# EAGLE design pwmTransmitter (EAGLE 9.6.2)
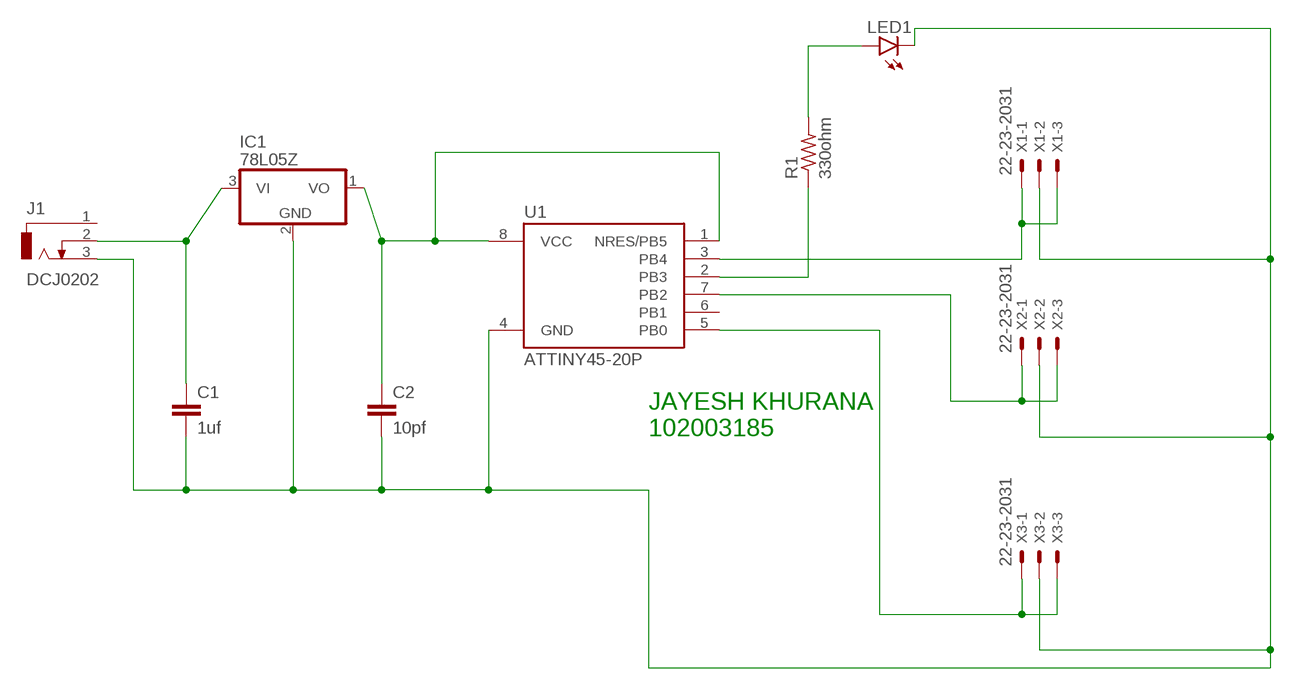
[diagram p0: schematic, sheet 1]

## Parts
C1  1uf  C2.5/2  [C2.5-2]
C2  10pf  C2.5/2  [C2.5-2]
IC1  78L05Z  [TO92]
J1  DCJ0202  [DCJ0202]
LED1  LED3MM  [LED3MM]
R1  330ohm  R-US_0207/10  [0207/10]
U1  ATTINY45-20P  [PDIP08_300MIL]
X1  22-23-2031  [22-23-2031]
X2  22-23-2031  [22-23-2031]
X3  22-23-2031  [22-23-2031]

## Nets
N$1: C1.1 IC1.3(VI) J1.2
N$2: C1.2 C2.2 IC1.2(GND) J1.3 LED1.K(C) U1.4(GND) X1.2 X2.2 X3.2
N$3: C2.1 IC1.1(VO) U1.1(NRES/PB5) U1.8(VCC)
N$4: R1.1 U1.2(PB3)
N$5: U1.3(PB4) X1.1 X1.3
N$6: U1.7(PB2) X2.1 X2.3
N$7: U1.5(PB0) X3.1 X3.3
N$8: LED1.A R1.2
Unconnected: J1.1 U1.6(PB1)

## Notes on the sheet
- JAYESH KHURANA
  102003185

## Library data of the parts
C1 C2 = capacitor-wima:C: CAPACITOR naming: grid - package width
IC1 = linear:78*: Positive VOLTAGE REGULATOR Source: http://cache.national.com/ds/LM/LM78L05.pdf http://www.fairchildsemi.com/ds/LM/LM7805.pdf
J1 = con-jack:DCJ0202: DC POWER JACK Source: DCJ0202.pdf; OC_FARNELL: unknown; OC_NEWARK: unknown
LED1 = led:LED: LED OSRAM: - CHIPLED LG R971, LG N971, LY N971, LG Q971, LY Q971, LO R971, LY R971 LH N974, LH R974 LS Q976, LO Q976, LY Q976 LO Q996 - Hyper CHIPLED LW Q18S LB Q993, LB Q99A, LB R99A - SideLED LS A670, LO A670, LY A670, LG A670, LP A670 LB A673, LV A673, LT A673, LW A673 LH A674 LY A675 LS A676, LA A676, LO A676, LY A676, LW A676 LS A679, LY A679, LG A679 - Hyper Micro SIDELED® LS Y876, LA Y876, LO Y876, LY Y876 LT Y87S - SmartLED LW L88C, LW L88S LB L89C, LB L89S, LG L890 LS L89K, LO L89K, LY L89K LS L896, LA L896, LO L896, LY L896 - TOPLED LS T670, LO T670, LY T670, LG T670, LP T670 LSG T670, LSP T670, LSY T670, LOP T670, LYG T670 LG T671, LOG T671, LSG T671 LB T673, LV T673, LT T673, LW T673 LH T674 LS T676, LA T676, LO T676, LY T676, LB T676, LH T676, LSB T676, LW T676 LB T67C, LV T67C, LT T67C, LS T67K, LO T67K, LY T67K, LW E67C LS E67B, LA E67B, LO E67B, LY E67B, LB E67C, LV E67C, LT E67C LW T67C LS T679, LY T679, LG T679 LS T770, LO T770, LY T770, LG T770, LP T770 LB T773, LV T773, LT T773, LW T773 LH T774 LS E675, LA E675, LY E675, LS T675 LS T776, LA T776, LO T776, LY T776, LB T776 LHGB T686 LT T68C, LB T68C - Hyper Mini TOPLED® LB M676 - Mini TOPLED Santana® LG M470 LS M47K, LO M47K, LY M47K Source: http://www.osram.convergy.de LUXEON: - LUMILED® LXK2-PW12-R00, LXK2-PW12-S00, LXK2-PW14-U00, LXK2-PW14-V00 LXK2-PM12-R00, LXK2-PM12-S00, LXK2-PM14-U00 LXK2-PE12-Q00, LXK2-PE12-R00, LXK2-PE12-S00, LXK2-PE14-T00, LXK2-PE14-U00 LXK2-PB12-K00, LXK2-PB12-L00, LXK2-PB12-M00, LXK2-PB14-N00, LXK2-PB14-P00, LXK2-PB14-Q00 LXK2-PR12-L00, LXK2-PR12-M00, LXK2-PR14-Q00, LXK2-PR14-R00 LXK2-PD12-Q00, LXK2-PD12-R00, LXK2-PD12-S00 LXK2-PH12-R00, LXK2-PH12-S00 LXK2-PL12-P00, LXK2-PL12-Q00, LXK2-PL12-R00 Source: www.luxeon.com KINGBRIGHT: KA-3528ASYC Source: www.kingbright.com
R1 = rcl:R-US_: RESISTOR, American symbol; SPICEPREFIX: R
U1 = _hhn_attiny25_45_85:ATTINY45*: ATMEL ATtiny 45 Packages: P = PDIP 08 30mil S = SOIC 08 EIAJ 208mil X = TSSOP 08 4.4mm Technologies Note: for complete ordering code (temp. range, finish, tape&reel etc.) see www.atmel.com • Supply Voltage: V = (1.8…5.5)V | [blank] = (2.7…5.5)V • Speed: 10 = 10 MHz | 20 = 20 MHz Author: Dipl.-Ing. FH Rainer Bayer HHN Hochschule Heilbronn (Heilbronn University), rainer.bayer@hs-heilbronn.de Ingenieurbüro ing-rb, mail@ing-rb.de
X1-X3 = con-molex:22-23-2031: .100" (2.54mm) Center Header - 3 Pin; MF: MOLEX; MPN: 22-23-2031; OC_FARNELL: 1462950; OC_NEWARK: 30C0862

## Board
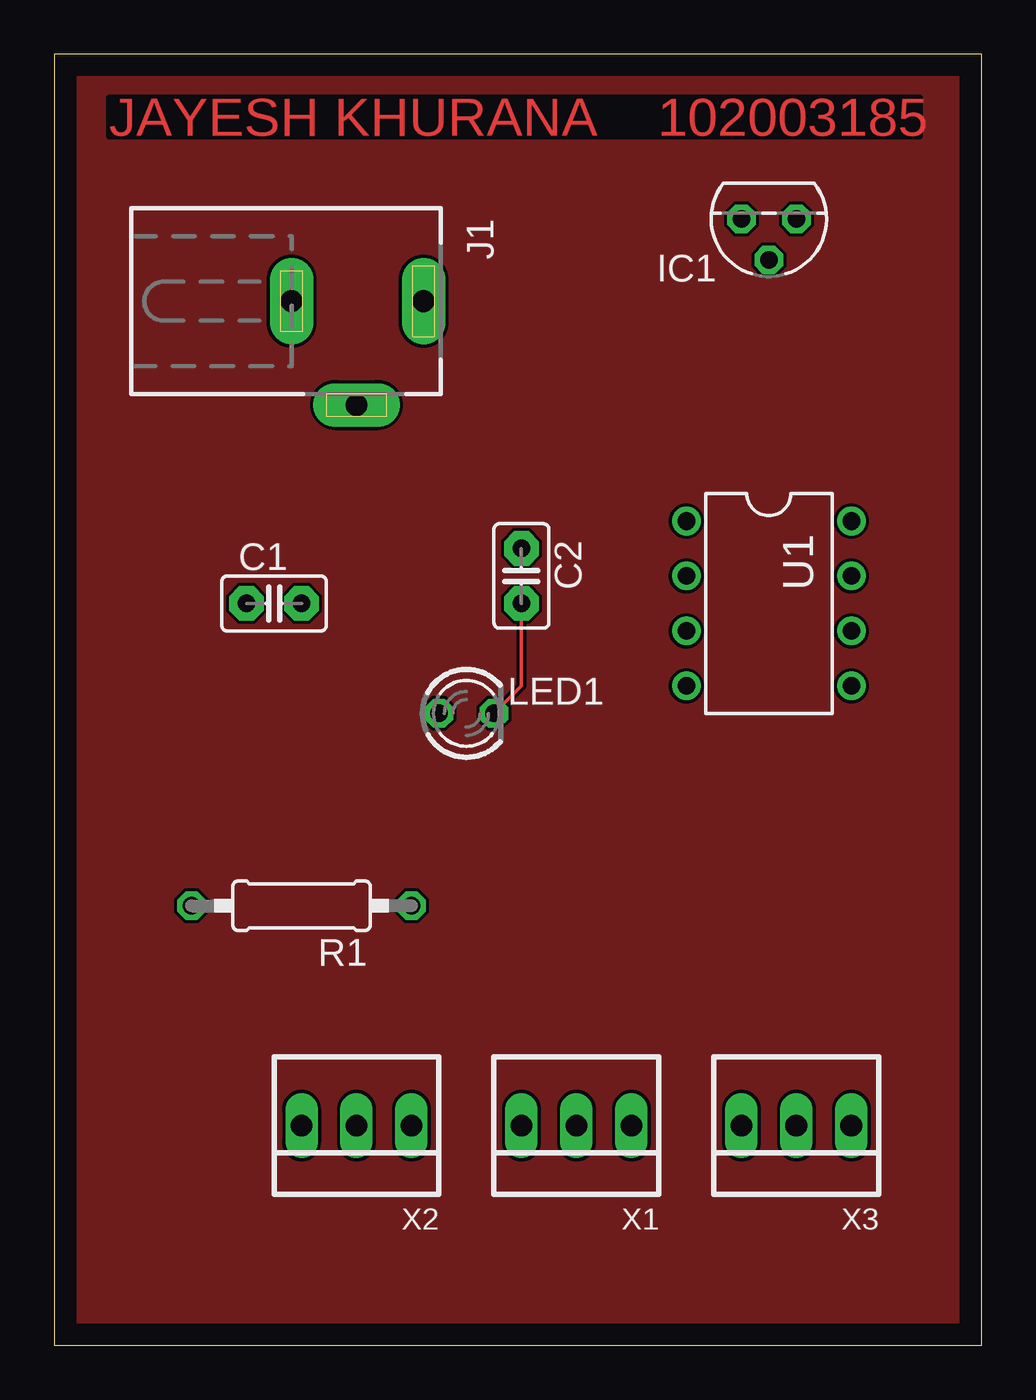
[diagram p1: board, top side]
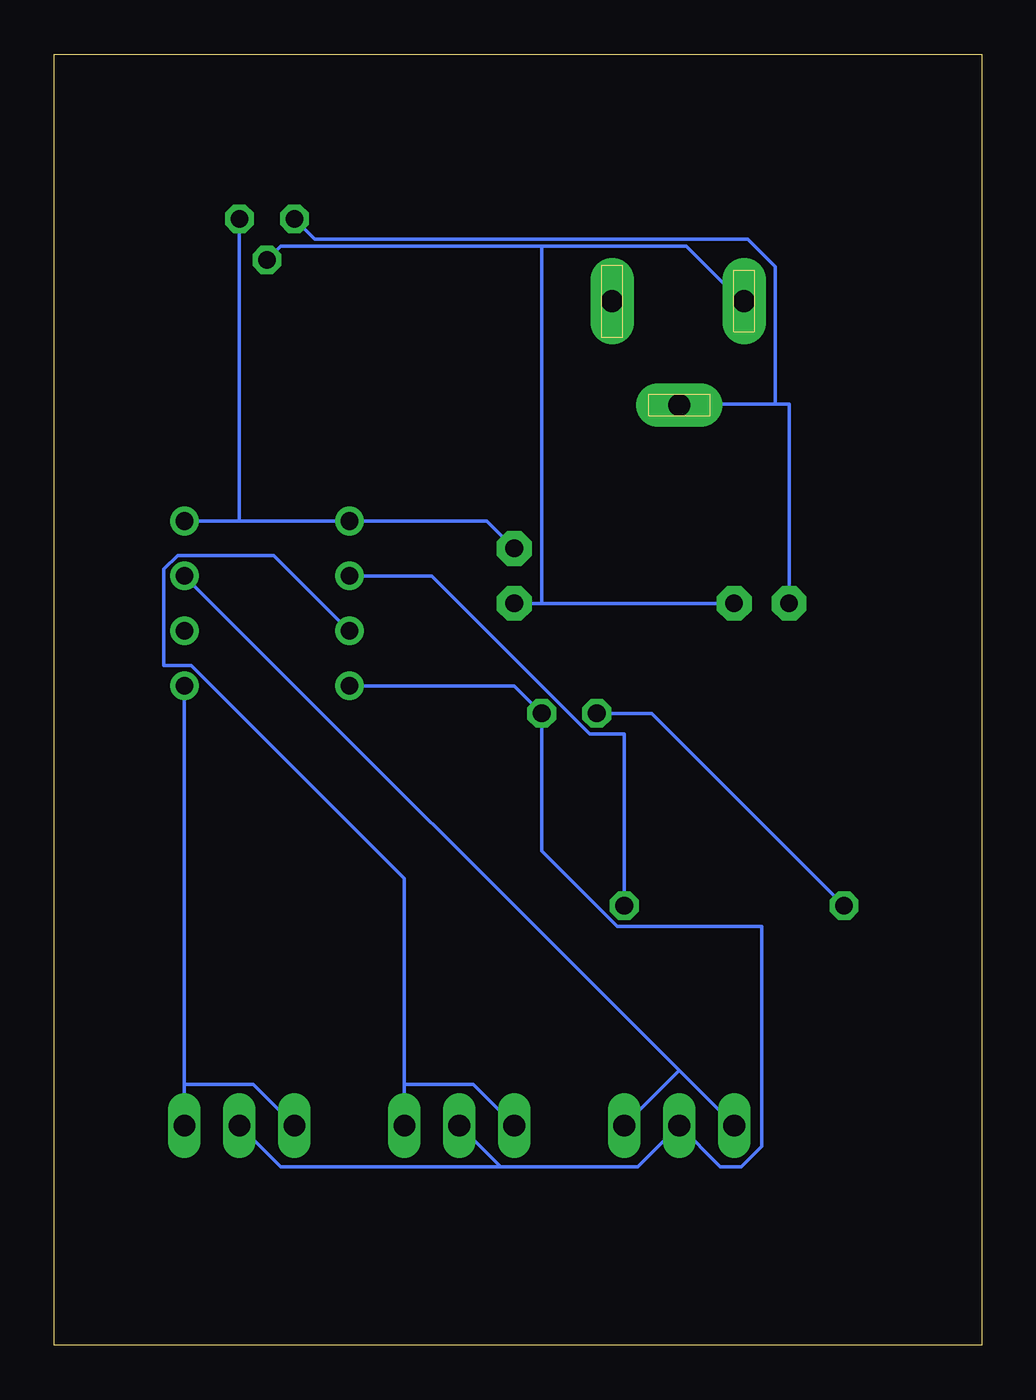
[diagram p2: board, bottom side, seen from below]

Size 42.85 x 59.68 mm. Coordinates in mm from the lower left corner, seen from the top.
Outline: 0,0 42.85,0 42.85,59.68 0,59.68 0,0
Copper layers (1*16): Top 0.035mm / dielectric 1.5mm / Bottom 0.035mm
Design rules "default": minimum track width 6mil, minimum drill 0.35mm, track to track 6mil, track to pad 6mil, pad to pad 6mil, via to via 6mil, smd to smd 6mil, copper to edge 40mil, drill to drill 6mil, minimum pad ring 10mil, minimum via ring 8mil, stop-mask expansion 4mil, vias tented up to drill 0mil, thermal gap 10mil

### Footprints (pad centres in the part's own frame; a part is rotated, then mirrored left to right if it is on the bottom)
C2.5-2 = drill 0.813 pad 1.6 octagon: 1 -1.27,0; 2 1.27,0
TO92 = drill 0.813 octagon: 1 -1.27,0; 2 0,1.905; 3 1.27,0
DCJ0202 = drill 1 pad 2 long: 1 0,3.1; 2 4.8,0; 3 0,-3
LED3MM = drill 0.813 octagon: A -1.27,0; K 1.27,0
0207/10 = drill 0.813 octagon: 1 -5.08,0; 2 5.08,0
PDIP08_300MIL = drill 0.813: 1 -3.81,-3.81; 2 -1.27,-3.81; 3 1.27,-3.81; 4 3.81,-3.81; 5 3.81,3.81; 6 1.27,3.81; 7 -1.27,3.81; 8 -3.81,3.81
22-23-2031 = drill 1 long: 1 -2.54,0; 2 0,0; 3 2.54,0

### Placement (x,y rotation side)
C1  10.16,34.29 0 top
C2  21.59,35.56 270 top
IC1  33.02,52.07 180 top
J1  13.97,48.26 270 top
LED1  19.05,29.21 0 top
R1  11.43,20.32 180 top
U1  33.02,34.29 270 top
X1  24.13,10.16 180 top
X2  13.97,10.16 180 top
X3  34.29,10.16 180 top

### Tracks (layer width: path | path; a pad name or v marks a point on that pad's centre or on a via)
N$1
  Bottom 0.152: IC1.3 30.8,51.12 10.79,51.12 9.53,49.85 9.53,43.5 | 9.53,43.5 13.97,43.5 J1.2 | C1.1 8.89,43.5 9.53,43.5
N$2
  Top 0.152: LED1.K 21.59,30.48 C2.2
  Bottom 0.152: IC1.2 32.38,50.8 20.32,50.8 | 20.32,50.8 13.65,50.8 11.11,48.26 J1.3 | 22.23,8.25 15.88,8.25 X2.2 12.06,8.25 11.11,8.25 10.16,9.21 10.16,19.37 16.83,19.37 20.32,22.86 LED1.K 21.59,30.48 U1.4 | X1.2 22.23,8.25 | X3.2 32.38,8.25 22.23,8.25 | C2.2 20.32,34.29 | 20.32,34.29 C1.2 | 20.32,34.29 20.32,50.8
N$3
  Bottom 0.152: U1.8 34.29,38.1 | 34.29,38.1 U1.1 22.86,38.1 C2.1 | 34.29,38.1 IC1.1
N$4
  Bottom 0.152: R1.1 16.51,28.26 18.1,28.26 25.4,35.56 U1.2
N$5
  Bottom 0.152: U1.3 32.7,36.51 37.15,36.51 37.78,35.88 37.78,31.43 36.51,31.43 26.67,21.59 26.67,12.06 | X1.1 26.67,12.06 | X1.3 23.5,12.06 26.67,12.06
N$6
  Bottom 0.152: X2.3 13.97,12.7 | 13.97,12.7 U1.7 | 13.97,12.7 X2.1
N$7
  Bottom 0.152: X3.1 36.83,12.06 | 36.83,12.06 U1.5 | X3.3 33.66,12.06 36.83,12.06
N$8
  Bottom 0.152: R1.2 15.24,29.21 LED1.A
N$9
  pour Top: 0,59.69 43.18,59.69 43.18,0 0,0

### Text on the board
Top: JAYESH KHURANA 102003185